# Altium schematic sheet 01. MAIN.SchDoc
size A3; DocumentNumber: 1; SheetNumber: 1; SheetTotal: 12
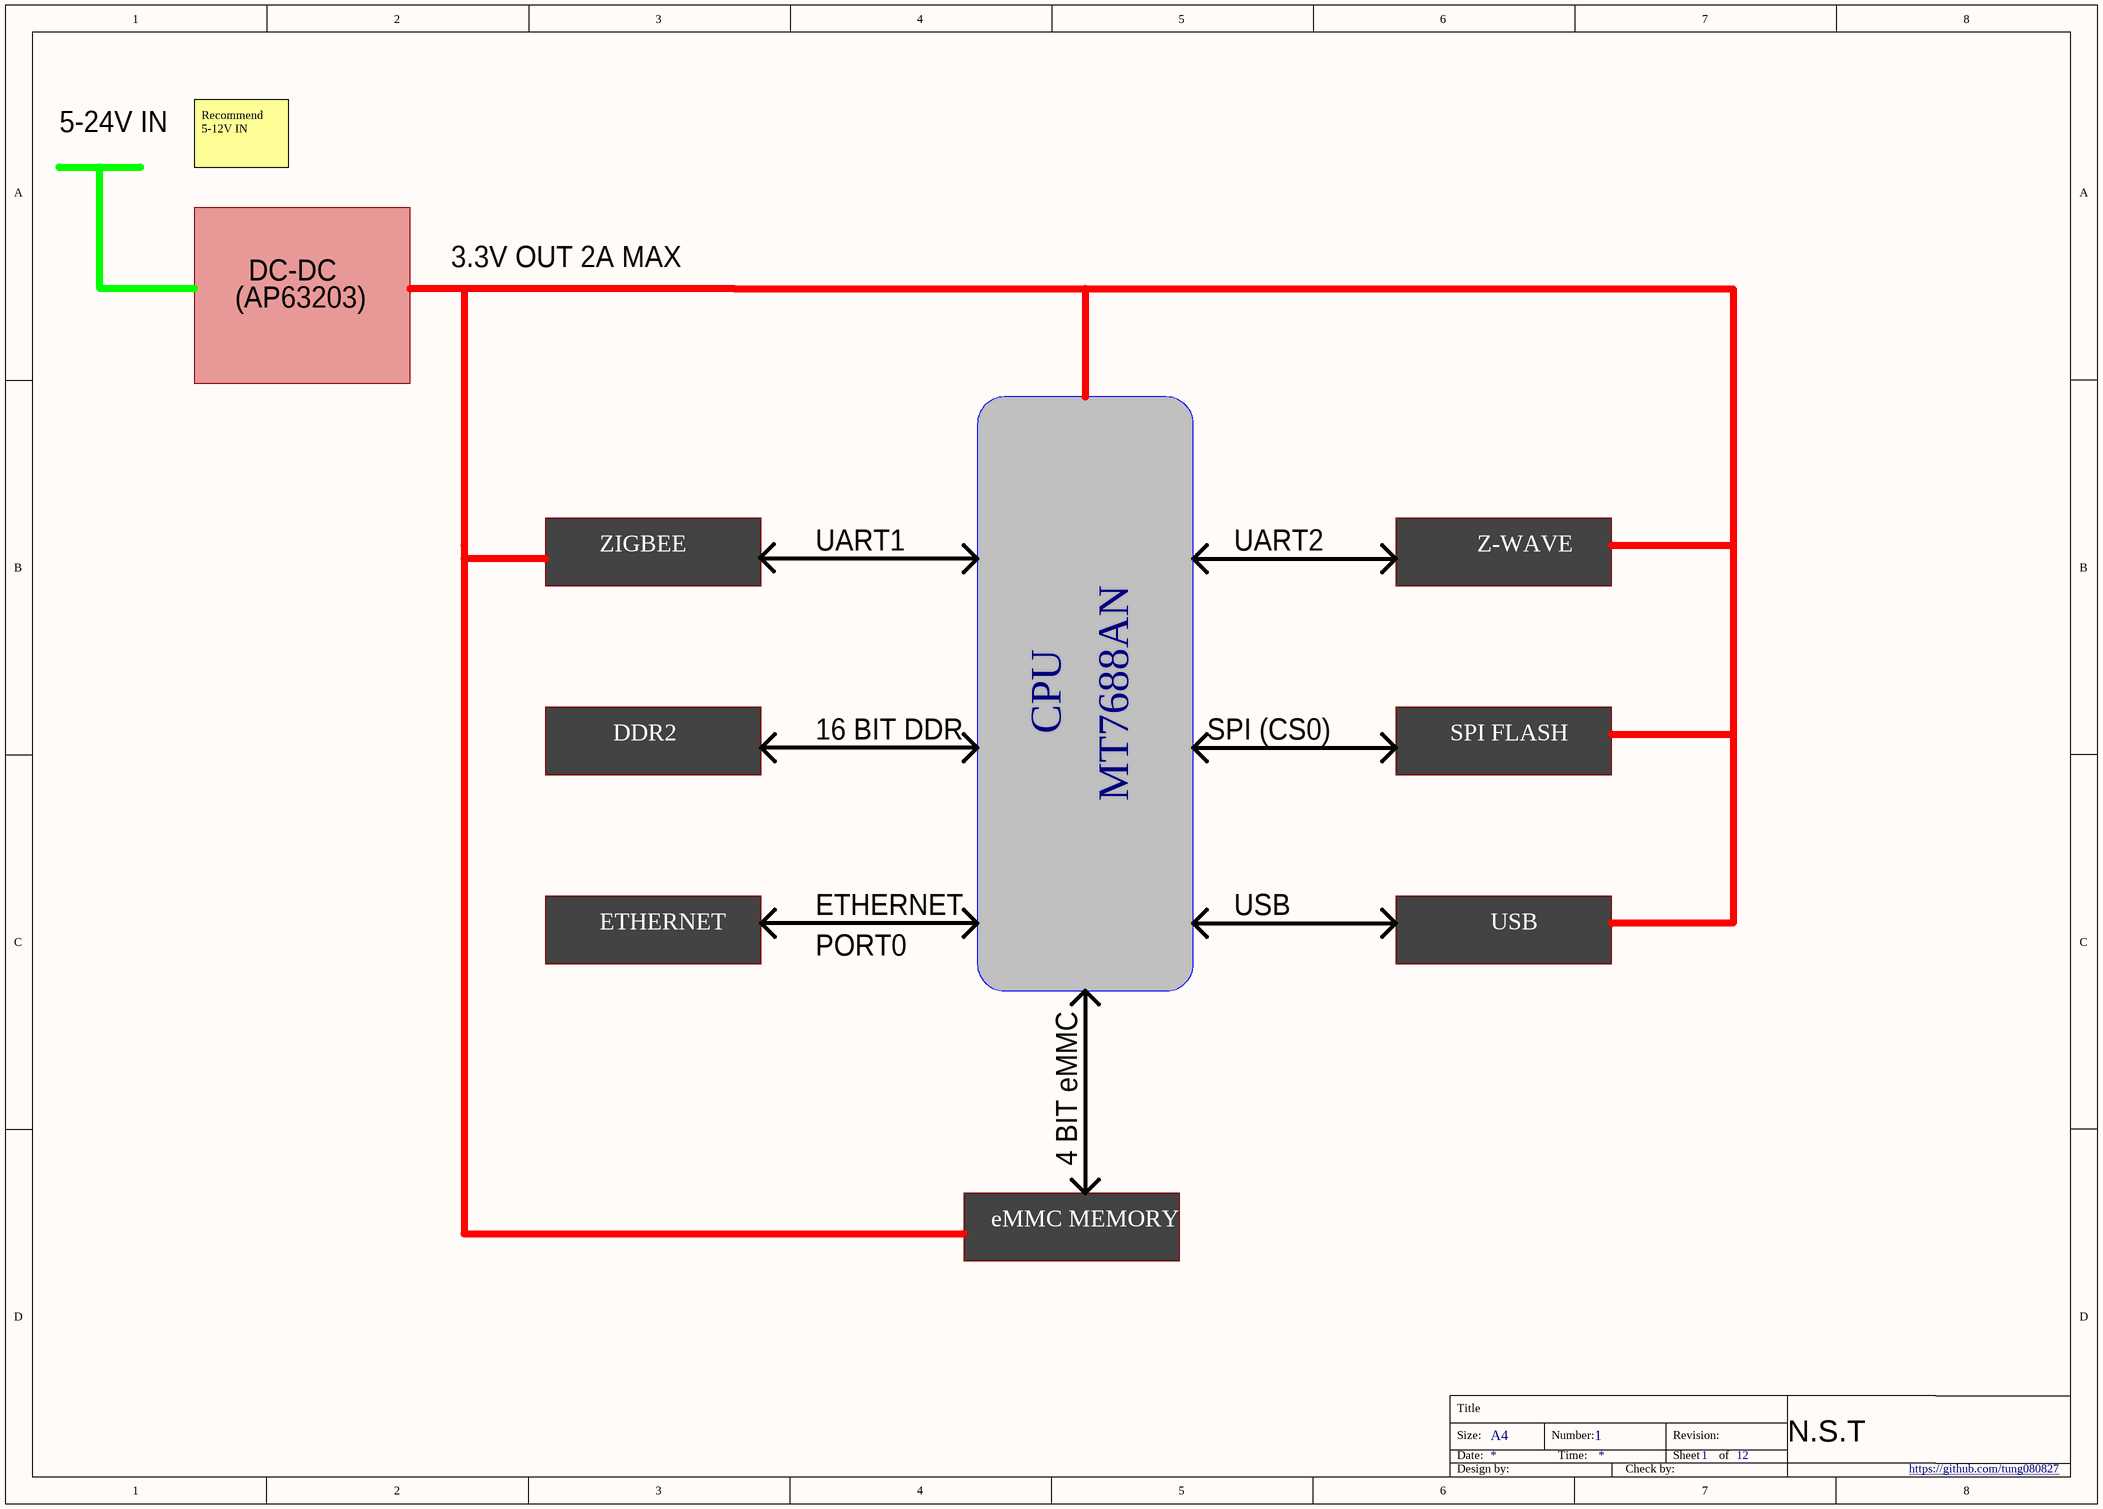
[diagram p0: 01. MAIN.SchDoc]

## Notes on the sheet
- 5-24V IN
- Recommend 5-12V IN
- (AP63203)
- DC-DC
- 3.3V OUT 2A MAX
- ZIGBEE
- UART1
- UART2
- Z-WAVE
- DDR2
- 16 BIT DDR
- CPU
- SPI (CS0)
- SPI FLASH
- MT7688AN
- ETHERNET
- USB
- PORT0
- 4 BIT eMMC
- eMMC MEMORY
- Title
- Size:
- Date:
- A4
- Number:
- Time:
- Revision:
- Sheet
- of
- N.S.T
- Design by:
- Check by:
- https://github.com/tung080827